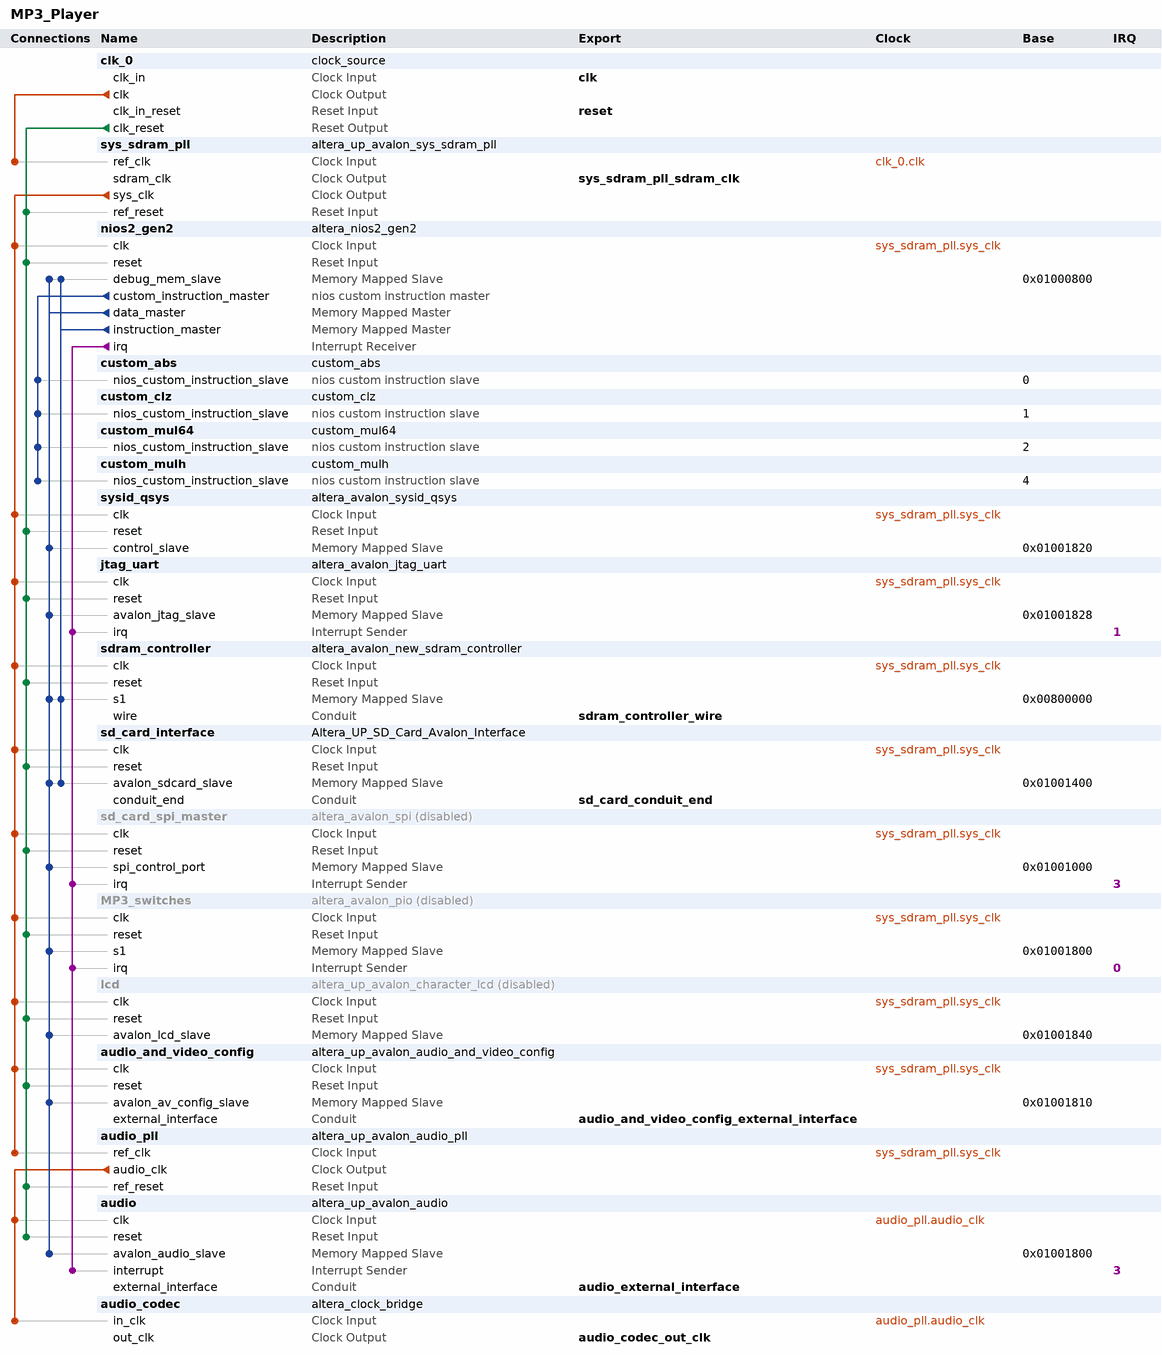
[diagram p0: system contents]
# Platform Designer (Qsys) system MP3_Player, Cyclone IV E EP4CE6E22C8
# Parameters at their usual value, and those the tool derives, are not listed.
package require -exact qsys 17.1
create_system MP3_Player
set_project_property DEVICE_FAMILY {Cyclone IV E}
set_project_property DEVICE EP4CE6E22C8

add_instance clk_0 clock_source 17.1
set_instance_parameter_value clk_0 clockFrequency 50000000

add_instance sys_sdram_pll altera_up_avalon_sys_sdram_pll 17.1
set_instance_parameter_value sys_sdram_pll CIV_boards DE0-Nano
set_instance_parameter_value sys_sdram_pll CV_boards DE10-Standard
set_instance_parameter_value sys_sdram_pll gui_outclk 50.0
set_instance_parameter_value sys_sdram_pll gui_refclk 50.0

add_instance nios2_gen2 altera_nios2_gen2 17.1
set_instance_parameter_value nios2_gen2 dcache_size 2048
set_instance_parameter_value nios2_gen2 exceptionSlave sdram_controller.s1
set_instance_parameter_value nios2_gen2 icache_size 4096
set_instance_parameter_value nios2_gen2 impl Tiny
set_instance_parameter_value nios2_gen2 resetSlave sdram_controller.s1

add_instance custom_abs custom_abs 1.0

add_instance custom_clz custom_clz 1.0

add_instance custom_mul64 custom_mul64 1.0

add_instance custom_mulh custom_mulh 1.0

add_instance sysid_qsys altera_avalon_sysid_qsys 17.1
set_instance_parameter_value sysid_qsys id 0

add_instance jtag_uart altera_avalon_jtag_uart 17.1
set_instance_parameter_value jtag_uart simInteractiveOptions NO_INTERACTIVE_WINDOWS

add_instance sdram_controller altera_avalon_new_sdram_controller 17.1
set_instance_parameter_value sdram_controller TAC 5.5
set_instance_parameter_value sdram_controller TRCD 20.0
set_instance_parameter_value sdram_controller TRP 20.0
set_instance_parameter_value sdram_controller casLatency 3
set_instance_parameter_value sdram_controller columnWidth 8
set_instance_parameter_value sdram_controller dataWidth 16
set_instance_parameter_value sdram_controller generateSimulationModel false
set_instance_parameter_value sdram_controller model single_Micron_MT48LC4M32B2_7_chip
set_instance_parameter_value sdram_controller numberOfBanks 4
set_instance_parameter_value sdram_controller numberOfChipSelects 1
set_instance_parameter_value sdram_controller powerUpDelay 100.0
set_instance_parameter_value sdram_controller refreshPeriod 15.625
set_instance_parameter_value sdram_controller rowWidth 12

add_instance sd_card_interface Altera_UP_SD_Card_Avalon_Interface 17.1

add_instance sd_card_spi_master altera_avalon_spi 17.1
set_instance_property sd_card_spi_master ENABLED false
set_instance_parameter_value sd_card_spi_master clockPolarity 0
set_instance_parameter_value sd_card_spi_master dataWidth 8
set_instance_parameter_value sd_card_spi_master masterSPI true
set_instance_parameter_value sd_card_spi_master numberOfSlaves 1
set_instance_parameter_value sd_card_spi_master targetClockRate 128000

add_instance MP3_switches altera_avalon_pio 17.1
set_instance_property MP3_switches ENABLED false
set_instance_parameter_value MP3_switches captureEdge true
set_instance_parameter_value MP3_switches direction Input
set_instance_parameter_value MP3_switches generateIRQ true
set_instance_parameter_value MP3_switches irqType EDGE
set_instance_parameter_value MP3_switches width 4

add_instance lcd altera_up_avalon_character_lcd 17.1
set_instance_property lcd ENABLED false
set_instance_parameter_value lcd cursor Normal

add_instance audio_and_video_config altera_up_avalon_audio_and_video_config 17.1
set_instance_parameter_value audio_and_video_config audio_in {Microphone to ADC}
set_instance_parameter_value audio_and_video_config bit_length 16
set_instance_parameter_value audio_and_video_config board DE10-Standard
set_instance_parameter_value audio_and_video_config data_format {I2S Format}
set_instance_parameter_value audio_and_video_config line_in_bypass false
set_instance_parameter_value audio_and_video_config sampling_rate {48 kHz}

add_instance audio_pll altera_up_avalon_audio_pll 17.1
set_instance_parameter_value audio_pll gui_refclk 50.0

add_instance audio altera_up_avalon_audio 17.1
set_instance_parameter_value audio audio_in false
set_instance_parameter_value audio avalon_bus_type {Memory Mapped}
set_instance_parameter_value audio dw 16

add_instance audio_codec altera_clock_bridge 17.1
set_instance_parameter_value audio_codec DERIVED_CLOCK_RATE 12288000
set_instance_parameter_value audio_codec EXPLICIT_CLOCK_RATE 0

# connections
add_connection audio_pll.audio_clk audio.clk clock
add_connection audio_pll.audio_clk audio_codec.in_clk clock
add_connection clk_0.clk sys_sdram_pll.ref_clk clock
add_connection sys_sdram_pll.sys_clk audio_and_video_config.clk clock
add_connection sys_sdram_pll.sys_clk audio_pll.ref_clk clock
add_connection sys_sdram_pll.sys_clk jtag_uart.clk clock
add_connection sys_sdram_pll.sys_clk lcd.clk clock
add_connection sys_sdram_pll.sys_clk MP3_switches.clk clock
add_connection sys_sdram_pll.sys_clk nios2_gen2.clk clock
add_connection sys_sdram_pll.sys_clk sd_card_interface.clk clock
add_connection sys_sdram_pll.sys_clk sd_card_spi_master.clk clock
add_connection sys_sdram_pll.sys_clk sdram_controller.clk clock
add_connection sys_sdram_pll.sys_clk sysid_qsys.clk clock
add_connection clk_0.clk_reset audio.reset reset
add_connection clk_0.clk_reset audio_and_video_config.reset reset
add_connection clk_0.clk_reset audio_pll.ref_reset reset
add_connection clk_0.clk_reset jtag_uart.reset reset
add_connection clk_0.clk_reset lcd.reset reset
add_connection clk_0.clk_reset MP3_switches.reset reset
add_connection clk_0.clk_reset nios2_gen2.reset reset
add_connection clk_0.clk_reset sd_card_interface.reset reset
add_connection clk_0.clk_reset sd_card_spi_master.reset reset
add_connection clk_0.clk_reset sdram_controller.reset reset
add_connection clk_0.clk_reset sys_sdram_pll.ref_reset reset
add_connection clk_0.clk_reset sysid_qsys.reset reset
add_connection nios2_gen2.data_master audio.avalon_audio_slave avalon
set_connection_parameter_value nios2_gen2.data_master/audio.avalon_audio_slave baseAddress 0x01001800
add_connection nios2_gen2.data_master audio_and_video_config.avalon_av_config_slave avalon
set_connection_parameter_value nios2_gen2.data_master/audio_and_video_config.avalon_av_config_slave baseAddress 0x01001810
add_connection nios2_gen2.data_master jtag_uart.avalon_jtag_slave avalon
set_connection_parameter_value nios2_gen2.data_master/jtag_uart.avalon_jtag_slave baseAddress 0x01001828
add_connection nios2_gen2.data_master lcd.avalon_lcd_slave avalon
set_connection_parameter_value nios2_gen2.data_master/lcd.avalon_lcd_slave baseAddress 0x01001840
add_connection nios2_gen2.data_master MP3_switches.s1 avalon
set_connection_parameter_value nios2_gen2.data_master/MP3_switches.s1 baseAddress 0x01001800
add_connection nios2_gen2.data_master nios2_gen2.debug_mem_slave avalon
set_connection_parameter_value nios2_gen2.data_master/nios2_gen2.debug_mem_slave baseAddress 0x01000800
add_connection nios2_gen2.data_master sd_card_interface.avalon_sdcard_slave avalon
set_connection_parameter_value nios2_gen2.data_master/sd_card_interface.avalon_sdcard_slave baseAddress 0x01001400
add_connection nios2_gen2.data_master sd_card_spi_master.spi_control_port avalon
set_connection_parameter_value nios2_gen2.data_master/sd_card_spi_master.spi_control_port baseAddress 0x01001000
add_connection nios2_gen2.data_master sdram_controller.s1 avalon
set_connection_parameter_value nios2_gen2.data_master/sdram_controller.s1 baseAddress 0x00800000
add_connection nios2_gen2.data_master sysid_qsys.control_slave avalon
set_connection_parameter_value nios2_gen2.data_master/sysid_qsys.control_slave baseAddress 0x01001820
add_connection nios2_gen2.instruction_master nios2_gen2.debug_mem_slave avalon
set_connection_parameter_value nios2_gen2.instruction_master/nios2_gen2.debug_mem_slave baseAddress 0x01000800
add_connection nios2_gen2.instruction_master sd_card_interface.avalon_sdcard_slave avalon
set_connection_parameter_value nios2_gen2.instruction_master/sd_card_interface.avalon_sdcard_slave baseAddress 0x01001400
add_connection nios2_gen2.instruction_master sdram_controller.s1 avalon
set_connection_parameter_value nios2_gen2.instruction_master/sdram_controller.s1 baseAddress 0x00800000
add_connection nios2_gen2.irq audio.interrupt interrupt
set_connection_parameter_value nios2_gen2.irq/audio.interrupt irqNumber 3
add_connection nios2_gen2.irq jtag_uart.irq interrupt
set_connection_parameter_value nios2_gen2.irq/jtag_uart.irq irqNumber 1
add_connection nios2_gen2.irq MP3_switches.irq interrupt
set_connection_parameter_value nios2_gen2.irq/MP3_switches.irq irqNumber 0
add_connection nios2_gen2.irq sd_card_spi_master.irq interrupt
set_connection_parameter_value nios2_gen2.irq/sd_card_spi_master.irq irqNumber 3
add_connection nios2_gen2.custom_instruction_master custom_abs.nios_custom_instruction_slave nios_custom_instruction
set_connection_parameter_value nios2_gen2.custom_instruction_master/custom_abs.nios_custom_instruction_slave CIName custom_abs
set_connection_parameter_value nios2_gen2.custom_instruction_master/custom_abs.nios_custom_instruction_slave baseAddress 0
add_connection nios2_gen2.custom_instruction_master custom_clz.nios_custom_instruction_slave nios_custom_instruction
set_connection_parameter_value nios2_gen2.custom_instruction_master/custom_clz.nios_custom_instruction_slave CIName custom_clz
set_connection_parameter_value nios2_gen2.custom_instruction_master/custom_clz.nios_custom_instruction_slave baseAddress 1
add_connection nios2_gen2.custom_instruction_master custom_mul64.nios_custom_instruction_slave nios_custom_instruction
set_connection_parameter_value nios2_gen2.custom_instruction_master/custom_mul64.nios_custom_instruction_slave CIName custom_mul64
set_connection_parameter_value nios2_gen2.custom_instruction_master/custom_mul64.nios_custom_instruction_slave baseAddress 2
add_connection nios2_gen2.custom_instruction_master custom_mulh.nios_custom_instruction_slave nios_custom_instruction
set_connection_parameter_value nios2_gen2.custom_instruction_master/custom_mulh.nios_custom_instruction_slave CIName custom_mulh
set_connection_parameter_value nios2_gen2.custom_instruction_master/custom_mulh.nios_custom_instruction_slave baseAddress 4

# exported interfaces
add_interface audio_and_video_config_external_interface conduit end
set_interface_property audio_and_video_config_external_interface EXPORT_OF audio_and_video_config.external_interface
add_interface audio_codec_out_clk clock source
set_interface_property audio_codec_out_clk EXPORT_OF audio_codec.out_clk
add_interface audio_external_interface conduit end
set_interface_property audio_external_interface EXPORT_OF audio.external_interface
add_interface clk clock sink
set_interface_property clk EXPORT_OF clk_0.clk_in
add_interface reset reset sink
set_interface_property reset EXPORT_OF clk_0.clk_in_reset
add_interface sd_card_conduit_end conduit end
set_interface_property sd_card_conduit_end EXPORT_OF sd_card_interface.conduit_end
add_interface sdram_controller_wire conduit end
set_interface_property sdram_controller_wire EXPORT_OF sdram_controller.wire
add_interface sys_sdram_pll_sdram_clk clock source
set_interface_property sys_sdram_pll_sdram_clk EXPORT_OF sys_sdram_pll.sdram_clk

set_interconnect_requirement {$system} qsys_mm.clockCrossingAdapter HANDSHAKE
set_interconnect_requirement {$system} qsys_mm.enableEccProtection FALSE
set_interconnect_requirement {$system} qsys_mm.insertDefaultSlave FALSE
set_interconnect_requirement {$system} qsys_mm.maxAdditionalLatency 1

save_system MP3_Player.qsys
